# Altium project HeadControllerMILANDR.PrjPcb
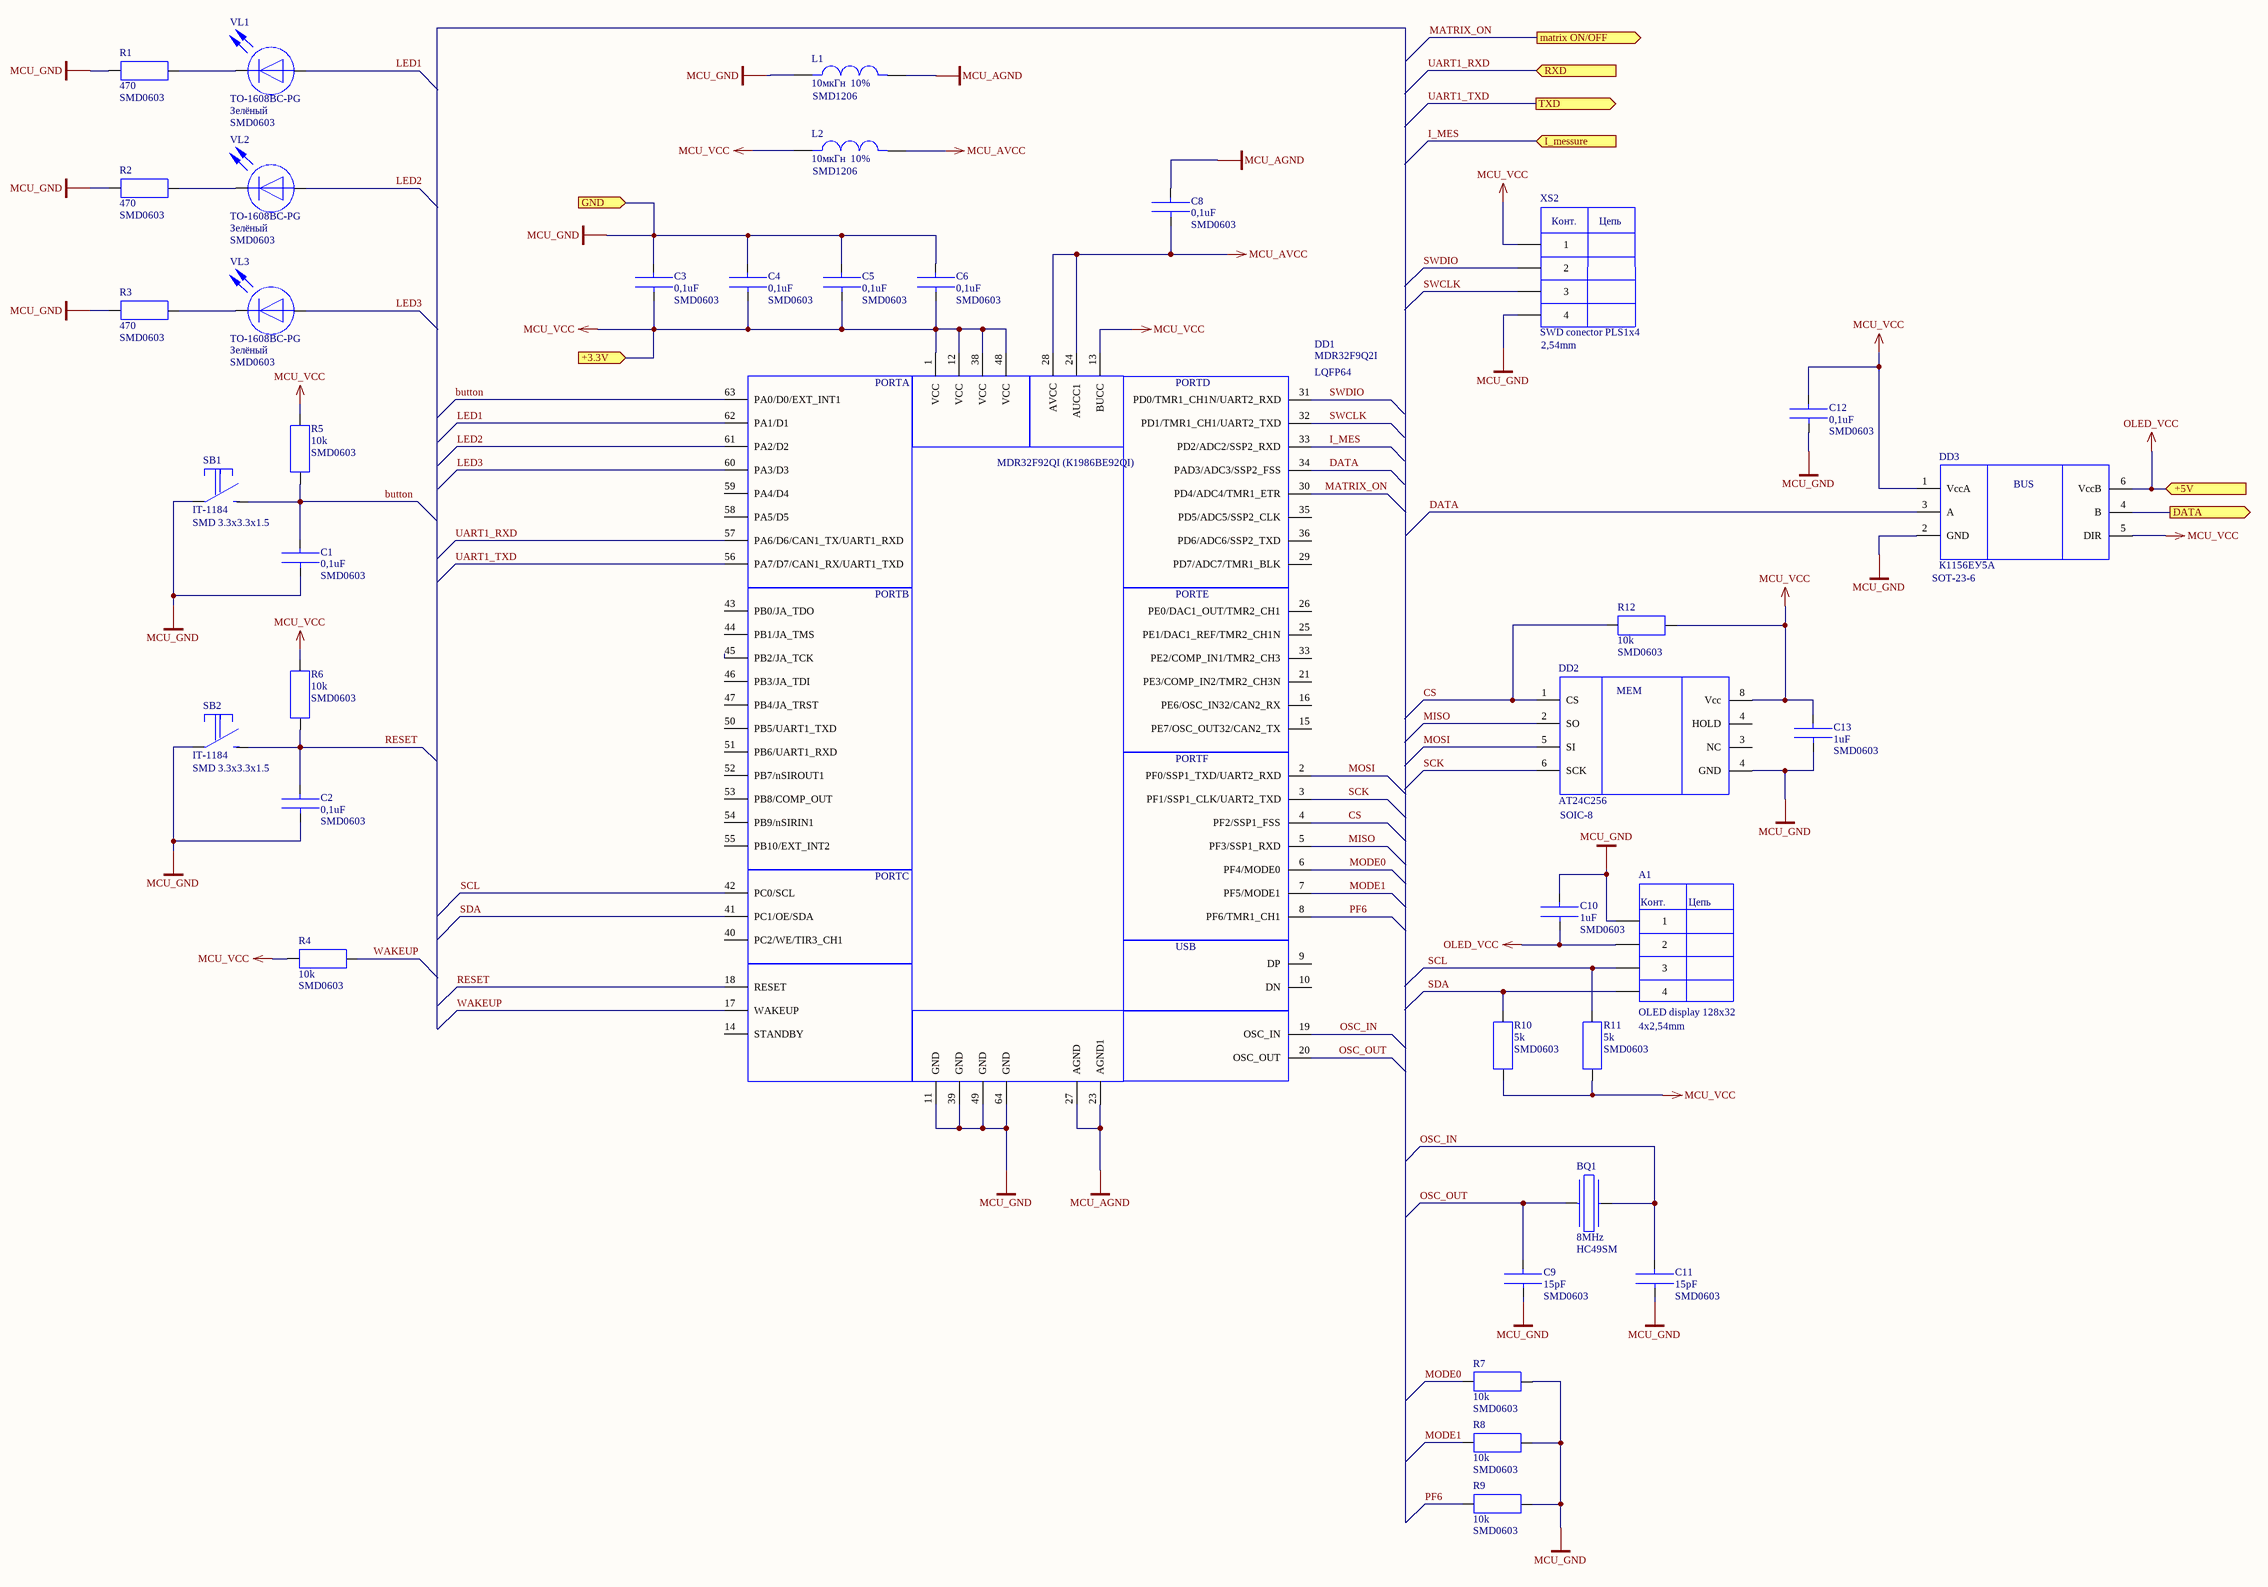
[diagram p0: MCU.SchDoc]
1 sheet, 37 parts. Net scope: flat (ports and power ports of the same name join across sheets).
Board file: HeadController_1.PcbDoc

## Sheet MCU.SchDoc
size A2

### Parts
A1  OLED display 128x32  Package: 4x2,54mm  [OLED 128x32]
BQ1  8МHz  Package: HC49SM  [BQ_HC49SM]
C1  0,1uF  Package: SMD0603  [SMD0603(1005)]
C2  0,1uF  Package: SMD0603  [SMD0603(1005)]
C3  0,1uF  Package: SMD0603  [SMD0603(1005)]
C4  0,1uF  Package: SMD0603  [SMD0603(1005)]
C5  0,1uF  Package: SMD0603  [SMD0603(1005)]
C6  0,1uF  Package: SMD0603  [SMD0603(1005)]
C8  0,1uF  Package: SMD0603  [SMD0603(1005)]
C9  15pF  Package: SMD0603  [SMD0603(1005)]
C10  1uF  Package: SMD0603  [SMD0603(1005)]
C11  15pF  Package: SMD0603  [SMD0603(1005)]
C12  0,1uF  Package: SMD0603  [SMD0603(1005)]
C13  1uF  Package: SMD0603  [SMD0603(1005)]
DD1  MDR32F9Q2I  Package: LQFP64  [LQFP-64]
DD2  AT24C256  Package: SOIC-8  [SOIC8]
DD3  К1156ЕУ5А  Package: SOT-23-6  [SOT23-6]
L1  10мкГн  10%  Package: SMD1206  [SMD1206(3216)]
L2  10мкГн  10%  Package: SMD1206  [SMD1206(3216)]
R1  470  Package: SMD0603  [SMD0603(1005)]
R2  470  Package: SMD0603  [SMD0603(1005)]
R3  470  Package: SMD0603  [SMD0603(1005)]
R4  10k  Package: SMD0603  [SMD0603(1005)]
R5  10k  Package: SMD0603  [SMD0603(1005)]
R6  10k  Package: SMD0603  [SMD0603(1005)]
R7  10k  Package: SMD0603  [SMD0603(1005)]
R8  10k  Package: SMD0603  [SMD0603(1005)]
R9  10k  Package: SMD0603  [SMD0603(1005)]
R10  5k  Package: SMD0603  [SMD0603(1005)]
R11  5k  Package: SMD0603  [SMD0603(1005)]
R12  10k  Package: SMD0603  [SMD0603(1005)]
SB1  IT-1184  Package: SMD 3.3x3.3x1.5  [IT-1184]
SB2  IT-1184  Package: SMD 3.3x3.3x1.5  [IT-1184]
VL1  TO-1608BC-PG  Light: Зелёный  Package: SMD0603  [LED_SMD0603(1005)]
VL2  TO-1608BC-PG  Light: Зелёный  Package: SMD0603  [LED_SMD0603(1005)]
VL3  TO-1608BC-PG  Light: Зелёный  Package: SMD0603  [LED_SMD0603(1005)]
XS2  SWD conector PLS1x4  Package: 2,54mm  [PLS1x4]

### Ports
+3.3V (in), +5V (in), DATA (out), GND (in), I_messure (in), matrix ON/OFF (out), RXD (in), TXD (out)

### Nets
MCU_AGND: C8.1 DD1.23(AGND1) DD1.27(AGND) L1.2(IN1)
MCU_AVCC: C8.2 DD1.24(AUCC1) DD1.28(AVCC) L2.2(IN1)
MCU_GND: A1.1 C1.2 C2.2 C3.1 C4.1 C5.1 C6.1 C9.1 C10.1 C11.1 C12.2 C13.2 DD1.11(GND) DD1.39(GND) DD1.49(GND) DD1.64(GND) DD2.4(HOLD) DD3.2(GND) L1.1(IN1) R1.2 R2.2 R3.2 R7.1 R8.1 R9.1 SB1.1 SB2.1 XS2.4 ; port GND
MCU_VCC: C3.2 C4.2 C5.2 C6.2 C12.1 C13.1 DD1.1(VCC) DD1.12(VCC) DD1.13(BUCC) DD1.38(VCC) DD1.48(VCC) DD2.8(Vcc) DD3.1(VccA) DD3.5(DIR) L2.1(IN1) R4.2 R5.2 R6.2 R10.1 R11.1 R12.2 XS2.1 ; port +3.3V
OLED_VCC: A1.2 C10.2 DD3.6(VccB) ; port +5V
button: C1.1 DD1.63(PA0/D0/EXT_INT1) R5.1 SB1.2
CS: DD1.4(PF2/SSP1_FSS) DD2.1(CS) R12.1
DATA: DD1.34(PAD3/ADC3/SSP2_FSS) DD3.3(A)
I_MES: DD1.33(PD2/ADC2/SSP2_RXD) ; port I_messure
LED1: DD1.62(PA1/D1) VL1.1
LED2: DD1.61(PA2/D2) VL2.1
LED3: DD1.60(PA3/D3) VL3.1
MATRIX_ON: DD1.30(PD4/ADC4/TMR1_ETR) ; port matrix ON/OFF
MISO: DD1.5(PF3/SSP1_RXD) DD2.2(SO)
MODE0: DD1.6(PF4/MODE0) R7.2
MODE1: DD1.7(PF5/MODE1) R8.2
MOSI: DD1.2(PF0/SSP1_TXD/UART2_RXD) DD2.5(SI)
OSC_IN: BQ1.2 C11.2 DD1.19(OSC_IN)
OSC_OUT: BQ1.1 C9.2 DD1.20(OSC_OUT)
PF6: DD1.8(PF6/TMR1_CH1) R9.2
RESET: C2.1 DD1.18(RESET) R6.1 SB2.2
SCK: DD1.3(PF1/SSP1_CLK/UART2_TXD) DD2.6(SCK)
SCL: A1.3 DD1.42(PC0/SCL) R11.2
SDA: A1.4 DD1.41(PC1/OE/SDA) R10.2
SWCLK: DD1.32(PD1/TMR1_CH1/UART2_TXD) XS2.3
SWDIO: DD1.31(PD0/TMR1_CH1N/UART2_RXD) XS2.2
UART1_RXD: DD1.57(PA6/D6/CAN1_TX/UART1_RXD) ; port RXD
UART1_TXD: DD1.56(PA7/D7/CAN1_RX/UART1_TXD) ; port TXD
WAKEUP: DD1.17(WAKEUP) R4.1
NetDD3_4: DD3.4(B) ; port DATA
NetR1_1: R1.1 VL1.2
NetR2_1: R2.1 VL2.2
NetR3_1: R3.1 VL3.2

Not connected (* = marked no-connect by the designer): DD1 9(DP) 10(DN) 14(STANDBY) 15(PE7/OSC_OUT32/CAN2_TX) 16(PE6/OSC_IN32/CAN2_RX) 21(PE3/COMP_IN2/TMR2_CH3N) 25(PE1/DAC1_REF/TMR2_CH1N) 26(PE0/DAC1_OUT/TMR2_CH1) 29(PD7/ADC7/TMR1_BLK) 35(PD5/ADC5/SSP2_CLK) 36(PD6/ADC6/SSP2_TXD) 40(PC2/WE/TIR3_CH1) 43(PB0/JA_TDO) 44(PB1/JA_TMS) 45(PB2/JA_TCK) 46(PB3/JA_TDI) 47(PB4/JA_TRST) 50(PB5/UART1_TXD) 51(PB6/UART1_RXD) 52(PB7/nSIROUT1) 53(PB8/COMP_OUT) 54(PB9/nSIRIN1) 55(PB10/EXT_INT2) 58(PA5/D5) 59(PA4/D4); DD2 3(NC)

### Notes on the sheet
- Title
- Size:
- Date:
- File:
- A2
- Number:
- Time:
- Revision:
- Sheet
- of
- (in symbol MDR32F9Q2I) PORTA; PORTD; MDR32F92QI (К1986ВЕ92QI); PORTB; PORTE; PORTF; PORTC; USB
- (in symbol PLS1x4) Конт.; Цепь
- (in symbol Дисплей OLED 128x32) Конт.; Цепь
- (in symbol Микросхема AT24C_256) MEM
- (in symbol Микросхема SN74LVC1T45DBVR) BUS
- (in symbol OLED) Цепь; Конт.; GND; Vcc; SCL; SDA

### Library data of the parts
A1 = Дисплей OLED 128x32: Type: A; Value: OLED display 128x32; ValueBOM: Дисплей OLED 128x32
BQ1 = BQ_HC49SM: ValueBOM: Кварцевый резонатор 8МГц HC49S; Type: BQ; Value: 8МHz
C1-C6 C8 C12 = CER_CUP_0603: Type: C; ValueBOM: Конденсатор керамический 0,1мкФ SMD 0603 1%; Value: 0,1uF
C9 C11 = CER_CUP_0603: Type: C; ValueBOM: Конденсатор керамический 15пФ SMD 0603 1%; Value: 15pF
C10 C13 = CER_CUP_0603: Type: C; ValueBOM: Конденсатор керамический 1мкФ SMD 0603 1%; Value: 1uF
DD1 = MDR32F9Q2I: ValueBOM: Микроконтроллер MDR32F9Q2I (К1986ВЕ92QI) LQFP64; Type: DD; Value: MDR32F9Q2I
DD2 = Микросхема AT24C_256: Последовательная энергонезависимая память; ValueBOM: Микросхема EEPROM AT24C256; Value: AT24C256; Type: DD
DD3 = Микросхема SN74LVC1T45DBVR: 1-битный шинный приемопередатчик с двуполярным питанием, тремя состояниями на выходе; ValueBOM: Микросхема К1156ЕУ5А; Type: DD; Value: К1156ЕУ5А
L1 L2 = L1: ValueBOM: Индуктивность 10 мкГн, SMD1206, 10%; Type: L; Value: 10мкГн  10%
R1-R3 = R_0603: ValueBOM: Резистор 470 Ом SMD 0603 1%; Type: R; Value: 470
R4-R9 R12 = R_0603: ValueBOM: Резистор 10кОм SMD 0603 1%; Type: R; Value: 10k
R10 R11 = R_0603: ValueBOM: Резистор 5кОм SMD 0603 1%; Type: R; Value: 5k
SB1 SB2 = Кнопка тактовая (универсальная): ValueBOM: Кнопка тактовая IT1184; Type: SB; Value: IT-1184
VL1-VL3 = LED_0603: ValueBOM: Светодиод зелёный TO-1608BC-PG SMD0603; Type: VL; Value: TO-1608BC-PG
XS2 = PLS1x4: ValueBOM: Разъём PLS1x4 прямой; Type: XS; Value: SWD conector PLS1x4